# Altium schematic sheet Power.SchDoc
size A4; SheetNumber: 1; SheetTotal: 4
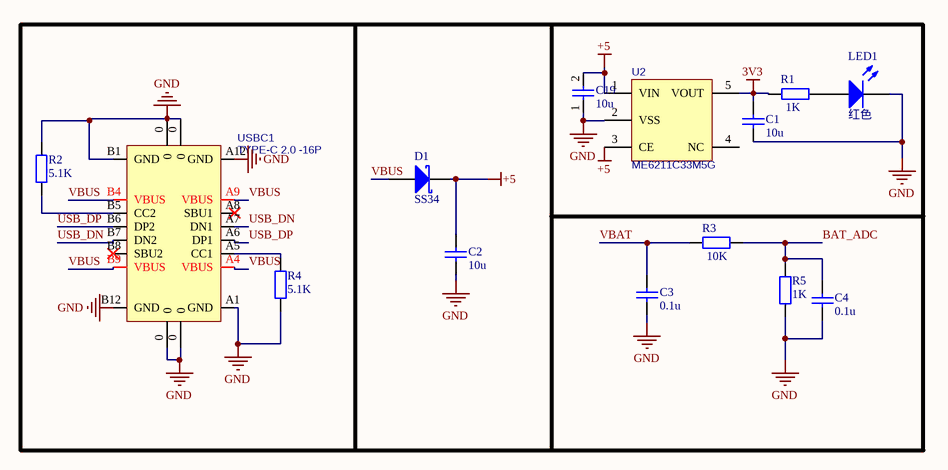
[diagram p0: Power.SchDoc]

## Parts
C1  10u  [C0402_M]
C2  10u  [C0402_M]
C3  0.1u  [C0402_M]
C4  0.1u  [C0402_M]
C19  10u  [C0402_M]
D1  SS34  [SOD-123]
LED1  红色  [LED0603_R]
R1  1K  [R0402_M]
R2  5.1K  [R0402_M]
R3  10K  [R0402_M]
R4  5.1K  [R0402_M]
R5  1K  [R0402_M]
U2  ME6211C33M5G  [SOT-23-5]
USBC1  TYPE-C 2.0 -16P  [USB-C-SMD_16P]

## Nets
3V3: C1.2 R1.1 U2.5(VOUT)
+5: C2.2 C19.2 D1.2(K) U2.1(VIN) U2.3(CE)
GND: C1.1 C2.1 C3.1 C4.2 C19.1 LED1.2(K) R2.2 R4.1 R5.1 U2.2(VSS) USBC1.0 USBC1.A1(GND) USBC1.A12(GND) USBC1.B1(GND) USBC1.B12(GND)
BAT_ADC: C4.1 R3.2 R5.2
USB_DN: USBC1.A7(DN1) USBC1.B7(DN2)
USB_DP: USBC1.A6(DP1) USBC1.B6(DP2)
VBAT: C3.2 R3.1
VBUS: D1.1(A) USBC1.A4(VBUS) USBC1.A9(VBUS) USBC1.B4(VBUS) USBC1.B9(VBUS)
NetLED1_1: LED1.1(A) R1.2
NetR2_1: R2.1 USBC1.B5(CC2)
NetR4_2: R4.2 USBC1.A5(CC1)

Not connected (* = marked no-connect by the designer): U2 4(NC); USBC1 A8(SBU1)* B8(SBU2)*

## Library data of the parts
C1-C4 C19 = C: 贴片电容/MLCC电容; BOM名称: 无极性贴片电容; 当前库版本V2022.12.25 @淘宝卖家:黄晶宝石: 最新版本发布https://shop463601444.taobao.com
D1 = SS34: 肖特基二极管; 属性: 40V/3A; 当前库版本V2022.12.25 @淘宝卖家:黄晶宝石: 最新版本发布https://shop463601444.taobao.com; BOM名称: 肖特基二极管
LED1 = LED: 贴片LED; 封装库来自淘宝卖家：黄晶宝石: 其他店铺购入均为盗版封装库，无更新权益，请立即申请退款，本店现金奖励200~1000元; BOM名称: 贴片LED
R1-R5 = R: 贴片电阻; 联系下单店铺卖家 免费帮你查找封装: 联系下单店铺卖家 免费技术支持; BOM名称: 贴片电阻
U2 = ME6211C33: LDO 3.3V/0.5A; BOM名称: RT9193-30GB; 当前库版本V2022.12.25 @淘宝卖家:黄晶宝石: 最新版本发布https://shop463601444.taobao.com
USBC1 = USB2.0_Type-C_16Pin: USB2.0_Type-C_16Pin母座; 当前库版本V2022.12.25 @淘宝卖家:黄晶宝石: 最新版本发布https://shop463601444.taobao.com